# Altium schematic sheet USB_PD_CONTROLLER.SchDoc: USB PD CONTROLLER
size A3; Author: Silvio Navaretti; CompanyName: ARDUINO; DrawnBy: Silvio Navaretti; Engineer: Silvio Navaretti; Organization: ARDUINO; SheetNumber: 33; SheetTotal: 51; RevAuthor: Silvio Navaretti
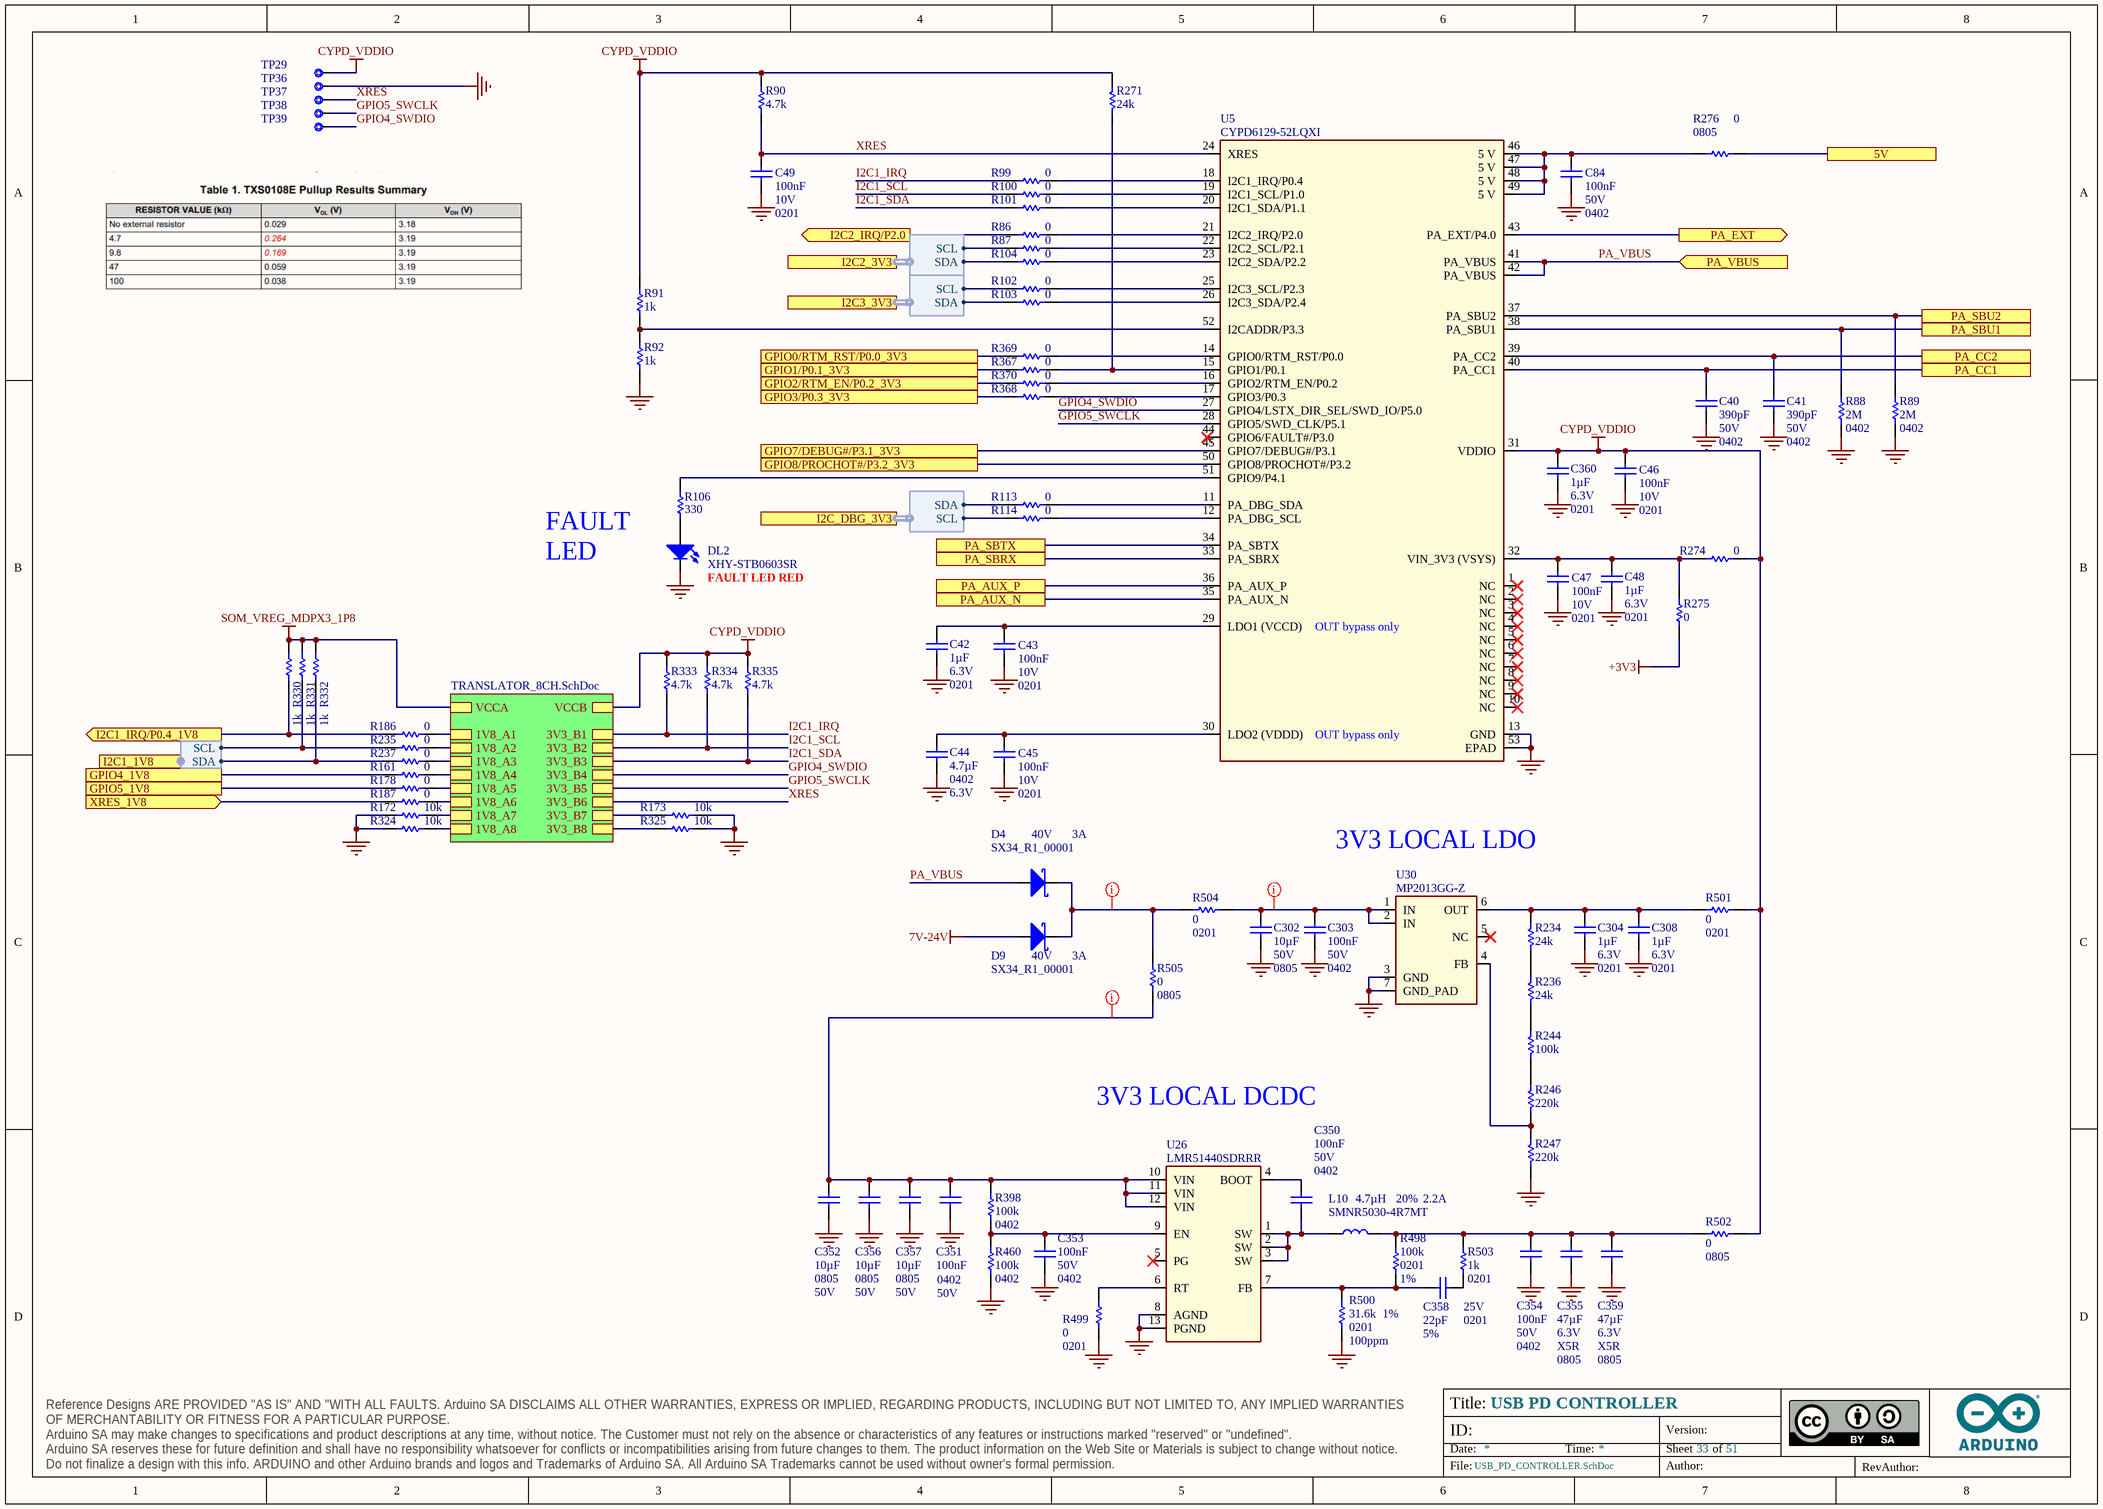
[diagram p0: USB_PD_CONTROLLER.SchDoc]

## Parts
C40  value 390pF  Voltage: 50V  Case Code (Imperial): 0402  [CAP-0402]  (hidden comment: CL05B391KB5NNNC)
C41  value 390pF  Voltage: 50V  Case Code (Imperial): 0402  [CAP-0402]  (hidden comment: CL05B391KB5NNNC)
C42  value 1µF  Voltage: 6.3V  Case Code (Imperial): 0201  [CAP-0201]  (hidden comment: GRM033R60J105MEA2D)
C43  value 100nF  Voltage: 10V  Case Code (Imperial): 0201  [CAP-0201]  (hidden comment: CL03A104KP3NNNC)
C44  value 4.7µF  Case Code (Imperial): 0402  Voltage: 6.3V  [CAP-0402]  (hidden comment: C1005A475M6R3NT)
C45  value 100nF  Voltage: 10V  Case Code (Imperial): 0201  [CAP-0201]  (hidden comment: CL03A104KP3NNNC)
C46  value 100nF  Voltage: 10V  Case Code (Imperial): 0201  [CAP-0201]  (hidden comment: CL03A104KP3NNNC)
C47  value 100nF  Voltage: 10V  Case Code (Imperial): 0201  [CAP-0201]  (hidden comment: CL03A104KP3NNNC)
C48  value 1µF  Voltage: 6.3V  Case Code (Imperial): 0201  [CAP-0201]  (hidden comment: GRM033R60J105MEA2D)
C49  value 100nF  Voltage: 10V  Case Code (Imperial): 0201  [CAP-0201]  (hidden comment: CL03A104KP3NNNC)
C84  value 100nF  Voltage: 50V  Case Code (Imperial): 0402  [CAP-0402]  (hidden comment: GRM155R61H104KE19D)
C302  value 10µF  Voltage: 50V  Case Code (Imperial): 0805  [CAP-0805]  (hidden comment: GRM21BR61H106ME43L)
C303  value 100nF  Voltage: 50V  Case Code (Imperial): 0402  [CAP-0402]  (hidden comment: GRM155R61H104KE19D)
C304  value 1µF  Voltage: 6.3V  Case Code (Imperial): 0201  [CAP-0201]  (hidden comment: GRM033R60J105MEA2D)
C308  value 1µF  Voltage: 6.3V  Case Code (Imperial): 0201  [CAP-0201]  (hidden comment: GRM033R60J105MEA2D)
C350  value 100nF  Voltage: 50V  Case Code (Imperial): 0402  [CAP-0402]  (hidden comment: GRM155R61H104KE19D)
C351  value 100nF  Voltage: 50V  Case Code (Imperial): 0402  [CAP-0402]  (hidden comment: GRM155R61H104KE19D)
C352  value 10µF  Case Code (Imperial): 0805  Voltage: 50V  [CAP-0805]  (hidden comment: GRM21BR61H106ME43L)
C353  value 100nF  Voltage: 50V  Case Code (Imperial): 0402  [CAP-0402]  (hidden comment: GRM155R61H104KE19D)
C354  value 100nF  Voltage: 50V  Case Code (Imperial): 0402  [CAP-0402]  (hidden comment: GRM155R61H104KE19D)
C355  value 47µF  Voltage: 6.3V  Dielectric: X5R  Case Code (Imperial): 0805  [CAP-0805]  (hidden comment: C0805C476M9PAC7800)
C356  value 10µF  Case Code (Imperial): 0805  Voltage: 50V  [CAP-0805]  (hidden comment: GRM21BR61H106ME43L)
C357  value 10µF  Case Code (Imperial): 0805  Voltage: 50V  [CAP-0805]  (hidden comment: GRM21BR61H106ME43L)
C358  value 22pF  Tolerance: 5%  Case Code (Imperial): 0201  Voltage: 25V  [CAP-0201]  (hidden comment: CC0201JPNPO8BN220)
C359  value 47µF  Voltage: 6.3V  Dielectric: X5R  Case Code (Imperial): 0805  [CAP-0805]  (hidden comment: C0805C476M9PAC7800)
C360  value 1µF  Voltage: 6.3V  Case Code (Imperial): 0201  [CAP-0201]  (hidden comment: GRM033R60J105MEA2D)
D4  SX34_R1_00001  Max Reverse Voltage (DC): 40V  Forward Current: 3A  [SMA DO214AC]
D9  SX34_R1_00001  Max Reverse Voltage (DC): 40V  Forward Current: 3A  [SMA DO214AC]
DL2  XHY-STB0603SR  [LEDC1608X80N-AK]
L10  SMNR5030-4R7MT  Tolerance: 20%  IRMS: 2.2A  Inductance: 4.7µH  [Inductor 5030]
R86  value 0  [RES-0201]  (hidden comment: CRCW02010000Z0ED)
R87  value 0  [RES-0201]  (hidden comment: CRCW02010000Z0ED)
R88  value 2M  Case Code (Imperial): 0402  [RES-0402]  (hidden comment: RC0402FR-072ML)
R89  value 2M  Case Code (Imperial): 0402  [RES-0402]  (hidden comment: RC0402FR-072ML)
R90  value 4.7k  [RES-0201]  (hidden comment: RC0201FR-074K7L)
R91  value 1k  [RES-0201]  (hidden comment: RC0201FR-071KL)
R92  value 1k  [RES-0201]  (hidden comment: RC0201FR-071KL)
R99  value 0  [RES-0201]  (hidden comment: CRCW02010000Z0ED)
R100  value 0  [RES-0201]  (hidden comment: CRCW02010000Z0ED)
R101  value 0  [RES-0201]  (hidden comment: CRCW02010000Z0ED)
R102  value 0  [RES-0201]  (hidden comment: CRCW02010000Z0ED)
R103  value 0  [RES-0201]  (hidden comment: CRCW02010000Z0ED)
R104  value 0  [RES-0201]  (hidden comment: CRCW02010000Z0ED)
R106  value 330  [RES-0201]  (hidden comment: AC0201FR-07330RL)
R113  value 0  [RES-0201]  (hidden comment: CRCW02010000Z0ED)
R114  value 0  [RES-0201]  (hidden comment: CRCW02010000Z0ED)
R161  value 0  [RES-0201]  (hidden comment: CRCW02010000Z0ED)
R172  value 10k  [RES-0201]  (hidden comment: RC0201FR-0710KL)
R173  value 10k  [RES-0201]  (hidden comment: RC0201FR-0710KL)
R178  value 0  [RES-0201]  (hidden comment: CRCW02010000Z0ED)
R186  value 0  [RES-0201]  (hidden comment: CRCW02010000Z0ED)
R187  value 0  [RES-0201]  (hidden comment: CRCW02010000Z0ED)
R234  value 24k  [RES-0201]  (hidden comment: RC0201FR-0724KL)
R235  value 0  [RES-0201]  (hidden comment: CRCW02010000Z0ED)
R236  value 24k  [RES-0201]  (hidden comment: RC0201FR-0724KL)
R237  value 0  [RES-0201]  (hidden comment: CRCW02010000Z0ED)
R244  value 100k  [RES-0201]  (hidden comment: RC0201FR-07100KL)
R246  value 220k  [RES-0201]  (hidden comment: AC0201FR-07220KL)
R247  value 220k  [RES-0201]  (hidden comment: AC0201FR-07220KL)
R271  value 24k  [RES-0201]  (hidden comment: RC0201FR-0724KL)
R274  value 0  [RES-0201]  (hidden comment: CRCW02010000Z0ED)
R275  value 0  [RES-0201]  (hidden comment: CRCW02010000Z0ED)
R276  value 0  Case Code (Imperial): 0805  [RES-0805]  (hidden comment: CRCW08050000Z0EB)
R324  value 10k  [RES-0201]  (hidden comment: RC0201FR-0710KL)
R325  value 10k  [RES-0201]  (hidden comment: RC0201FR-0710KL)
R330  value 1k  [RES-0201]  (hidden comment: RC0201FR-071KL)
R331  value 1k  [RES-0201]  (hidden comment: RC0201FR-071KL)
R332  value 1k  [RES-0201]  (hidden comment: RC0201FR-071KL)
R333  value 4.7k  [RES-0201]  (hidden comment: RC0201FR-074K7L)
R334  value 4.7k  [RES-0201]  (hidden comment: RC0201FR-074K7L)
R335  value 4.7k  [RES-0201]  (hidden comment: RC0201FR-074K7L)
R367  value 0  [RES-0201]  (hidden comment: CRCW02010000Z0ED)
R368  value 0  [RES-0201]  (hidden comment: CRCW02010000Z0ED)
R369  value 0  [RES-0201]  (hidden comment: CRCW02010000Z0ED)
R370  value 0  [RES-0201]  (hidden comment: CRCW02010000Z0ED)
R398  value 100k  Case Code (Imperial): 0402  [RES-0402]  (hidden comment: CRCW0402100KFKEDC)
R460  value 100k  Case Code (Imperial): 0402  [RES-0402]  (hidden comment: CRCW0402100KFKEDC)
R498  value 100k  Tolerance: 1%  Case Code (Imperial): 0201  [RES-0201]  (hidden comment: RC0201FR-07100KL)
R499  value 0  Case Code (Imperial): 0201  [RES-0201]  (hidden comment: CRCW02010000Z0ED)
R500  value 31.6k  Case Code (Imperial): 0201  Tolerance: 1%  Temperature Coefficient: 100ppm  [RES-0201]  (hidden comment: CRCW020131K6FKED)
R501  value 0  Case Code (Imperial): 0201  [RES-0201]  (hidden comment: CRCW02010000Z0ED)
R502  value 0  Case Code (Imperial): 0805  [RES-0805]  (hidden comment: CRCW08050000Z0EB)
R503  value 1k  Case Code (Imperial): 0201  [RES-0201]  (hidden comment: RC0201FR-071KL)
R504  value 0  Case Code (Imperial): 0201  [RES-0201]  (hidden comment: CRCW02010000Z0ED)
R505  value 0  Case Code (Imperial): 0805  [RES-0805]  (hidden comment: CRCW08050000Z0EB)
TP29  Test point 1.00mm  [TP-1.00MM]  (value not drawn)  (no BOM)
TP36  Test point 1.00mm  [TP-1.00MM]  (value not drawn)  (no BOM)
TP37  Test point 1.00mm  [TP-1.00MM]  (value not drawn)  (no BOM)
TP38  Test point 1.00mm  [TP-1.00MM]  (value not drawn)  (no BOM)
TP39  Test point 1.00mm  [TP-1.00MM]  (value not drawn)  (no BOM)
U5  CYPD6129-52LQXI  [QFN52 pitch 0.4mm, 5x8mm]
U26  LMR51440SDRRR  [WSON8 TI DDR 3x3mm 12 pins pitch 0.5mm]
U30  MP2013GG-Z  [MPS QNF6 2x2mm 6pin pitch 0.65mm thermal pad]

## Sub-sheets
T8CH_ = TRANSLATOR_8CH.SchDoc: 1V8_A1, 1V8_A2, 1V8_A3, 1V8_A4, 1V8_A5, 1V8_A6, 1V8_A7, 1V8_A8, 3V3_B1, 3V3_B2, 3V3_B3, 3V3_B4, 3V3_B5, 3V3_B6, 3V3_B7, 3V3_B8, VCCA, VCCB

## Ports
5V, GPIO0/RTM_RST/P0.0_3V3, GPIO1/P0.1_3V3, GPIO2/RTM_EN/P0.2_3V3, GPIO3/P0.3_3V3, GPIO4_1V8, GPIO5_1V8, GPIO7/DEBUG#/P3.1_3V3, GPIO8/PROCHOT#/P3.2_3V3, I2C1_1V8 (harness I2C), I2C1_IRQ/P0.4_1V8 (out), I2C2_3V3 (harness I2C), I2C2_IRQ/P2.0 (out), I2C3_3V3 (harness I2C), I2C_DBG_3V3 (harness I2C), PA_AUX_N, PA_AUX_P, PA_CC1, PA_CC2, PA_EXT (out), PA_SBRX, PA_SBTX, PA_SBU1, PA_SBU2, PA_VBUS (in), XRES_1V8 (in)

## Harnesses
I2C: SDA, SCL

## Nets
7V-24V: D9.A
+3V3: R275.1
CYPD_VDDIO: C46.2 C360.2 R90.1 R91.1 R271.2 R274.2 R333.1 R334.1 R335.1 R501.1 R502.2 TP29.X U5.31(VDDIO) ; sheet T8CH_/VCCB
GND: C40.1 C41.1 C42.1 C43.1 C44.2 C45.1 C46.1 C47.1 C48.1 C49.1 C84.1 C302.1 C303.2 C304.1 C308.1 C351.2 C352.2 C353.2 C354.2 C355.1 C356.2 C357.2 C359.1 C360.1 DL2.C R88.1 R89.1 R92.2 R172.1 R173.2 R247.2 R324.1 R325.2 R460.1 R499.1 R500.1 TP36.X U5.13(GND) U5.53(EPAD) U26.8(AGND) U26.13(PGND) U30.3(GND) U30.7(GND_PAD)
SOM_VREG_MDPX3_1P8: R330.1 R331.1 R332.1 ; sheet T8CH_/VCCA
5V: R276.2 ; port 5V
GPIO0/RTM_RST/P0.0_3V3: R369.1 ; port GPIO0/RTM_RST/P0.0_3V3
GPIO1/P0.1_3V3: R367.1 ; port GPIO1/P0.1_3V3
GPIO2/RTM_EN/P0.2_3V3: R370.1 ; port GPIO2/RTM_EN/P0.2_3V3
GPIO3/P0.3_3V3: R368.1 ; port GPIO3/P0.3_3V3
GPIO4_1V8: R161.1 ; port GPIO4_1V8
GPIO4_SWDIO: TP39.X U5.27(GPIO4/LSTX_DIR_SEL/SWD_IO/P5.0) ; sheet T8CH_/3V3_B4
GPIO5_1V8: R178.1 ; port GPIO5_1V8
GPIO5_SWCLK: TP38.X U5.28(GPIO5/SWD_CLK/P5.1) ; sheet T8CH_/3V3_B5
GPIO7/DEBUG#/P3.1_3V3: U5.45(GPIO7/DEBUG#/P3.1) ; port GPIO7/DEBUG#/P3.1_3V3
GPIO8/PROCHOT#/P3.2_3V3: U5.50(GPIO8/PROCHOT#/P3.2) ; port GPIO8/PROCHOT#/P3.2_3V3
I2C1_IRQ: R99.1 R333.2 ; sheet T8CH_/3V3_B1
I2C1_IRQ/P0.4_1V8: R186.1 R330.2 ; port I2C1_IRQ/P0.4_1V8
I2C1_SCL: R100.1 R334.2 ; sheet T8CH_/3V3_B2
I2C1_SDA: R101.1 R335.2 ; sheet T8CH_/3V3_B3
I2C2_IRQ/P2.0: R86.1 ; port I2C2_IRQ/P2.0
PA_AUX_N: U5.35(PA_AUX_N) ; port PA_AUX_N
PA_AUX_P: U5.36(PA_AUX_P) ; port PA_AUX_P
PA_CC1: C40.2 U5.40(PA_CC1) ; port PA_CC1
PA_CC2: C41.2 U5.39(PA_CC2) ; port PA_CC2
PA_EXT: U5.43(PA_EXT/P4.0) ; port PA_EXT
PA_SBRX: U5.33(PA_SBRX) ; port PA_SBRX
PA_SBTX: U5.34(PA_SBTX) ; port PA_SBTX
PA_SBU1: R88.2 U5.38(PA_SBU1) ; port PA_SBU1
PA_SBU2: R89.2 U5.37(PA_SBU2) ; port PA_SBU2
PA_VBUS: D4.A U5.41(PA_VBUS) U5.42(PA_VBUS) ; port PA_VBUS
XRES: C49.2 R90.2 TP37.X U5.24(XRES) ; sheet T8CH_/3V3_B6
XRES_1V8: R187.1 ; port XRES_1V8
NetC42_2: C42.2 C43.2 U5.29(LDO1_(VCCD))
NetC44_1: C44.1 C45.2 U5.30(LDO2_(VDDD))
NetC47_2: C47.2 C48.2 R274.1 R275.2 U5.32(VIN_3V3_(VSYS))
NetC84_2: C84.2 R276.1 U5.46(5_V) U5.47(5_V) U5.48(5_V) U5.49(5_V)
NetC302_2: C302.2 C303.1 R504.1 U30.1(IN) U30.2(IN)
NetC304_2: C304.2 C308.2 R234.2 R501.2 U30.6(OUT)
NetC350_1: C350.1 U26.4(BOOT)
NetC350_2: C350.2 L10.1 U26.1(SW) U26.2(SW) U26.3(SW)
NetC351_1: C351.1 C352.1 C356.1 C357.1 R398.2 R505.1 U26.10(VIN) U26.11(VIN) U26.12(VIN)
NetC353_1: C353.1 R398.1 R460.2 U26.9(EN)
NetC354_1: C354.1 C355.2 C359.2 L10.2 R498.2 R502.1 R503.2
NetC358_1: C358.1 R503.1
NetC358_2: C358.2 R498.1 R500.2 U26.7(FB)
NetD4_C: D4.C D9.C R504.2 R505.2
NetDL2_A: DL2.A R106.1
NetR86_2: R86.2 U5.21(I2C2_IRQ/P2.0)
NetR87_1: R87.1 ; port I2C2_3V3.SCL
NetR87_2: R87.2 U5.22(I2C2_SCL/P2.1)
NetR91_2: R91.2 R92.1 U5.52(I2CADDR/P3.3)
NetR99_2: R99.2 U5.18(I2C1_IRQ/P0.4)
NetR100_2: R100.2 U5.19(I2C1_SCL/P1.0)
NetR101_2: R101.2 U5.20(I2C1_SDA/P1.1)
NetR102_1: R102.1 ; port I2C3_3V3.SCL
NetR102_2: R102.2 U5.25(I2C3_SCL/P2.3)
NetR103_1: R103.1 ; port I2C3_3V3.SDA
NetR103_2: R103.2 U5.26(I2C3_SDA/P2.4)
NetR104_1: R104.1 ; port I2C2_3V3.SDA
NetR104_2: R104.2 U5.23(I2C2_SDA/P2.2)
NetR106_2: R106.2 U5.51(GPIO9/P4.1)
NetR113_1: R113.1 ; port I2C_DBG_3V3.SDA
NetR113_2: R113.2 U5.11(PA_DBG_SDA)
NetR114_1: R114.1 ; port I2C_DBG_3V3.SCL
NetR114_2: R114.2 U5.12(PA_DBG_SCL)
NetR161_2: R161.2 ; sheet T8CH_/1V8_A4
NetR172_2: R172.2 ; sheet T8CH_/1V8_A7
NetR173_1: R173.1 ; sheet T8CH_/3V3_B7
NetR178_2: R178.2 ; sheet T8CH_/1V8_A5
NetR186_2: R186.2 ; sheet T8CH_/1V8_A1
NetR187_2: R187.2 ; sheet T8CH_/1V8_A6
NetR234_1: R234.1 R236.2
NetR235_1: R235.1 R331.2 ; port I2C1_1V8.SCL
NetR235_2: R235.2 ; sheet T8CH_/1V8_A2
NetR236_1: R236.1 R244.2
NetR237_1: R237.1 R332.2 ; port I2C1_1V8.SDA
NetR237_2: R237.2 ; sheet T8CH_/1V8_A3
NetR244_1: R244.1 R246.1
NetR246_2: R246.2 R247.1 U30.4(FB)
NetR271_1: R271.1 R367.2 U5.15(GPIO1/P0.1)
NetR324_2: R324.2 ; sheet T8CH_/1V8_A8
NetR325_1: R325.1 ; sheet T8CH_/3V3_B8
NetR368_2: R368.2 U5.17(GPIO3/P0.3)
NetR369_2: R369.2 U5.14(GPIO0/RTM_RST/P0.0)
NetR370_2: R370.2 U5.16(GPIO2/RTM_EN/P0.2)
NetR499_2: R499.2 U26.6(RT)

Not connected (* = marked no-connect by the designer): U5 1(NC)* 2(NC)* 3(NC)* 4(NC)* 5(NC)* 6(NC)* 7(NC)* 8(NC)* 9(NC)* 10(NC)* 44(GPIO6/FAULT#/P3.0)*; U26 5(PG)*; U30 5(NC)*

## Layout directives
net class HIGH_CLEARANCE: NetC302_2, NetC351_1, NetD4_C

## Notes on the sheet
- FAULT LED
- (near DL2) FAULT LED RED
- 3V3 LOCAL LDO
- 3V3 LOCAL DCDC
- Title:
- ID:
- Date:
- Time:
- Version:
- Sheet
- of
- RevAuthor:
- Reference Designs ARE PROVIDED "AS IS" AND "WITH ALL FAULTS. Arduino SA DISCLAIMS ALL OTHER WARRANTIES, EXPRESS OR IMPLIED, REGARDING PRODUCTS, INCLUDING BUT NOT LIMITED TO, ANY IMPLIED WARRANTIES OF MERCHANTABILITY OR FITNESS FOR A PARTICULAR PURPOSE.
  Arduino SA may make changes to specifications and product descriptions at any time, without notice. The Customer must not rely on the absence or characteristics of any features or instructions marked "reserved" or "undefined".
  Arduino SA reserves these for future definition and shall have no responsibility whatsoever for conflicts or incompatibilities arising from future changes to them. The product information on the Web Site or Materials is subject to change without notice.
  Do not finalize a design with this info. ARDUINO and other Arduino brands and logos and Trademarks of Arduino SA. All Arduino SA Trademarks cannot be used without owner's formal permission.
- File:
- Author:
- (in symbol U0495-A.3) OUT bypass only

## Library data of the parts
C40 C41 = C0197-A.2: CAP CHIP 0402 390pF 10% 50V X7R; Manufacturer: Murata; Code Arduino: C0197; Part Number: CL05B391KB5NNNC; Technology: Ceramic; Tolerance: 10%; Dielectric: X7R
C42 C48 C304 C308 C360 = C0002-A.15: CAP CHIP 0201 1uF 20% 6.3V X5R; Manufacturer: Murata; Code Arduino: A5520; Tolerance: 20%; Dielectric: X5R; Part Number: GRM033R60J105MEA2D; Technology: Ceramic
C43 C45-C47 C49 = C0113-A.6: CAP CHIP 0201 100nF 10% 10V X5R; Manufacturer: Samsung Electro-Mechanics; Code Arduino: C0113; Technology: Ceramic; Part Number: CL03A104KP3NNNC; Dielectric: X5R; Tolerance: 10%
C44 = C0037-A.14: CAP CHIP 0402 4.7uF 20% 6V3 X5R; Manufacturer: Hottech; Code Arduino: 0833; Dielectric: X5R; Technology: Ceramic; Part Number: C1005A475M6R3NT; Manufacturer 2: Samsung Electro-Mechanics; Tolerance: 20%; Manufacturer 3: Murata Electronics; Part number 3: GRM155R60J475ME47D; Part number 2: CL05A475KQ5NRNC
C84 C303 C350 C351 C353 C354 = C0015-A.14: CAP CHIP 0402 100nF 10% 50V X5R; Manufacturer: Murata; Code Arduino: A5141; Technology: Ceramic; Part Number: GRM155R61H104KE19D; Dielectric: X5R; Tolerance: 10%
C302 C352 C356 C357 = C0158-A.3: CAP CHIP 0805 10uF 20% 50V X5R; Manufacturer: Murata Electronics; Code Arduino: C0158; Dielectric: X5R; Technology: SMD; Part Number: GRM21BR61H106ME43L; Tolerance: 20%
C355 C359 = C0199-A.1: CAP CHIP 0805 47uF 20% 6.3V X5R; Manufacturer: KEMET; Code Arduino: C0199; Technology: Ceramic; Tolerance: 20%; Part Number: C0805C476M9PAC7800
C358 = C0115-A.6: CAP CHIP 0201 22pF 5% 25V C0G; Manufacturer: Yageo; Code Arduino: C0115; Part Number: CC0201JPNPO8BN220; Technology: Ceramic; Dielectric: C0G
D4 D9 = D0109-A.2: DIODE SCHOTTKY SMD 3A 40V SMA DO214AC; Part Number: SX34-AU_R1_000A1; Manufacturer: Panjit; Code Arduino: D0109; Forward Voltage: 0.39V; Device Type: Diode Schottky
DL2 = L0024-A.4: LED SMD 0603 RED 625nm, water clear, 42 to 88 mcd, 120 degrees, 1.6x0.8x0.6mm; Manufacturer: Shenzen Corehy Technology; Code Arduino: L0024; Pin Count: 2; Part Number: XHY-STB0603SR
L10 = I0133-A.2: IND SMD 4.7uH 20%, DCR max 65mR, I sat 3A, I RMS 2.2A, package 5x5mm height 3mm; Manufacturer: Shun Xiang Nuo; DCR max: 65m; Code Arduino: I0133; Part Number: SMNR5030-4R7MT; ISAT: 3A
R86 R87 R99-R104 R113 R114 R161 R178 R186 R187 R235 R237 R274 R275 R367-R370 R499 R501 R504 = R0140-A.21: RES CHIP 0201 0R; Manufacturer: Vishay; Temperature coefficient: 0ppm; Code Arduino: R0140; Power: 50mW; Tolerance: 0%; Technology: Thick film; Part Number: CRCW02010000Z0ED
  R86 R87 R99-R104 R113 R114 R161 R178 R186 R187 R235 R237 R274 R275 R367-R370: Case Code (Imperial): 0201
R88 R89 = R0394-A.1: RES CHIP 0402 2M 1% 1/16W; Manufacturer: YAGEO; Temperature coefficient: 100ppm; Code Arduino: R0394; Power: 62.5mW; Technology: Thick film; Part Number: RC0402FR-072ML; Tolerance: 1%
R90 R333-R335 = R0151-A.21: RES CHIP 0201 4k7 1% 1/20W; Manufacturer: Yageo; Power: 50mW; Temperature coefficient: 200ppm; Code Arduino: A5521; Tolerance: 1%; Case Code (Imperial): 0201; Technology: Thick film; Part Number: RC0201FR-074K7L
R91 R92 R330-R332 R503 = R0195-A.22: RES CHIP 0201 1k 1% 1/20W; Manufacturer: Yageo; Power: 50mW; Temperature coefficient: 200ppm; Code Arduino: R0195; Part Number: RC0201FR-071KL; Tolerance: 1%; Technology: Thick film
  R91 R92 R330-R332: Case Code (Imperial): 0201
R106 = R0149-A.21: RES CHIP 0201 330R 1% 1/20W; Manufacturer: Yageo; Power: 50mW; Code Arduino: R0149; Temperature coefficient: 200ppm; Case Code (Imperial): 0201; Manufacturer 2: Samsung Electro-Mechanics; Tolerance: 1%; Part Number: AC0201FR-07330RL; Technology: Thick film
R172 R173 R324 R325 = R0145-A.21: RES CHIP 0201 10k 1% 1/20W; Manufacturer: Yageo; Power: 50mW; Temperature coefficient: 200ppm; Code Arduino: R0145; Manufacturer 2: Samsung Electro-Mechanics; Tolerance: 1%; Case Code (Imperial): 0201; Part Number: RC0201FR-0710KL; Technology: Thick film
R234 R236 R271 = R0398-A.1: RES CHIP 0201 24k 1% 1/20W; Manufacturer: YAGEO; Power: 50mW; Code Arduino: R0398; Temperature Coefficient: 200ppm; Case Code (Imperial): 0201; Part Number: RC0201FR-0724KL; Technology: Thick film; Tolerance: 1%
R244 = R0146-A.21: RES CHIP 0201 100k 1% 1/20W; Manufacturer: Yageo; Power: 50mW; Temperature coefficient: 200ppm; Code Arduino: R0146; Manufacturer 2: Samsung Electro-Mechanics; Tolerance: 1%; Case Code (Imperial): 0201; Part Number: RC0201FR-07100KL; Technology: Thick film
R246 R247 = R0199-A.20: RES CHIP 0201 220k 1% 1/20W; Manufacturer: Yageo; Temperature coefficient: 200ppm; Power: 50mW; Code Arduino: R0199; Part Number: AC0201FR-07220KL; Tolerance: 1%; Case Code (Imperial): 0201; Technology: Thick film
R276 R502 R505 = R0131-A.13: RES CHIP 0805 0R; Manufacturer: Vishay; Temperature coefficient: 0ppm; Code Arduino: A5394; Power: 125mW; Tolerance: 0%; Technology: Thick film; Part Number: CRCW08050000Z0EB
R398 R460 = R0001-A.24: RES CHIP 0402 100k 1% 1/16W; Manufacturer: Vishay; Code Arduino: 0134; Temperature coefficient: 100ppm; Power: 62.5mW; Technology: Thick film; Part Number: CRCW0402100KFKEDC; Tolerance: 1%
R498 = R0146-A.21: RES CHIP 0201 100k 1% 1/20W; Manufacturer: Yageo; Code Arduino: R0146; Temperature coefficient: 200ppm; Power: 50mW; Technology: Thick film; Part Number: RC0201FR-07100KL; Manufacturer 2: Samsung Electro-Mechanics
R500 = R0420-A.1: RES CHIP 0201 31k6 1% 1/20W 100ppm; Manufacturer: Vishay; Power: 50mW; Code Arduino: R0420; Technology: Thick film; Part Number: CRCW020131K6FKED
TP29 TP36-TP39 = UT0013-A.6: Part Number: This is not a component; Design Item ID: CMP-018-0005-A.3; Source: ut.SchLib; Manufacturer: This is not a component; Code Arduino: This is not a component; Pin Count: 1
U5 = U0495-A.3: IC Controller power delivery USB-C, QFN52 5x8mm; Manufacturer: Infineon; Code Arduino: U0495; Part Number: CYPD6129-52LQXI
U26 = U0467-A.1: IC BUCK Vin 4-36V, Iout 4A, max duty 97%, fsw 1.1MHz, WSON8 3x3mm; Manufacturer: Texas Instruments; Code Arduino: U0467; Part Number: LMR51440SDRRR
U30 = U0518-A.2: IC LDO, Vin 2.5V-40V, Vout ADJ, Iout 0.15A, Iq typ 15uA, QFN6 2x2mm; Manufacturer: MPS; Code Arduino: U0518; Part Number: MP2013GG-Z